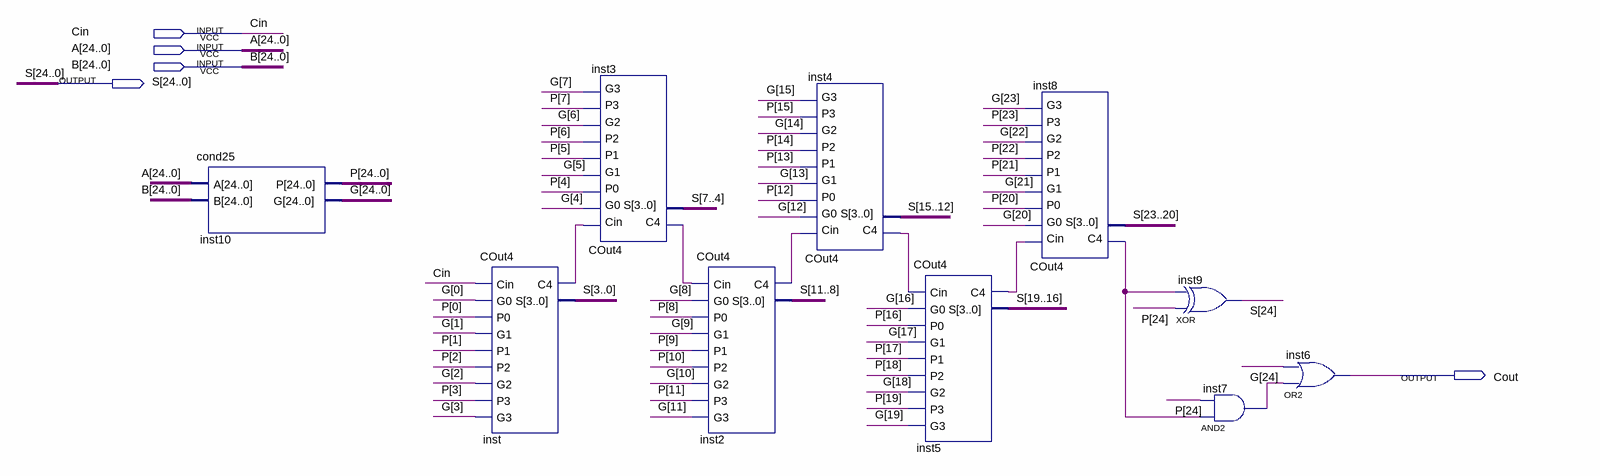
[diagram p0: schematic sheet]
// Quartus schematic CLHA25.bdf as structural Verilog: 10 symbols, 5 pins
module CLHA25 (
  input  Cin,
  input  [24:0] A,
  input  [24:0] B,
  output [24:0] S,
  output Cout
);

  wire inst2_c4, inst3_c4, inst4_c4, inst5_c4, inst7_out, inst8_c4, inst_c4;
  wire [24:0] G, P;

  cond25 inst10 (.A(A), .B(B), .P(P), .G(G));
  COut4 inst (
    .Cin(Cin), .G0(G[0]), .P0(P[0]), .G1(G[1]), .P1(P[1]), .P2(P[2]), .G2(G[2]), .P3(P[3]), .G3(G[3]),
    .C4(inst_c4), .S(S[3:0]));
  COut4 inst3 (
    .Cin(inst_c4), .G0(G[4]), .P0(P[4]), .G1(G[5]), .P1(P[5]), .P2(P[6]), .G2(G[6]), .P3(P[7]), .G3(G[7]),
    .C4(inst3_c4), .S(S[7:4]));
  COut4 inst2 (
    .Cin(inst3_c4), .G0(G[8]), .P0(P[8]), .G1(G[9]), .P1(P[9]), .P2(P[10]), .G2(G[10]), .P3(P[11]),
    .G3(G[11]), .C4(inst2_c4), .S(S[11:8]));
  COut4 inst4 (
    .Cin(inst2_c4), .G0(G[12]), .P0(P[12]), .G1(G[13]), .P1(P[13]), .P2(P[14]), .G2(G[14]), .P3(P[15]),
    .G3(G[15]), .C4(inst4_c4), .S(S[15:12]));
  COut4 inst5 (
    .Cin(inst4_c4), .G0(G[16]), .P0(P[16]), .G1(G[17]), .P1(P[17]), .P2(P[18]), .G2(G[18]), .P3(P[19]),
    .G3(G[19]), .C4(inst5_c4), .S(S[19:16]));
  COut4 inst8 (
    .Cin(inst5_c4), .G0(G[20]), .P0(P[20]), .G1(G[21]), .P1(P[21]), .P2(P[22]), .G2(G[22]), .P3(P[23]),
    .G3(G[23]), .C4(inst8_c4), .S(S[23:20]));
  xor inst9 (S[24], P[24], inst8_c4);
  and inst7 (inst7_out, inst8_c4, P[24]);
  or inst6 (Cout, inst7_out, G[24]);
endmodule
